# Altium schematic sheet wi-fi.SchDoc
size 420 x 297 mm; Address1: Address1; Address2: Address2; Address3: Address3; Address4: Address4; DocumentNumber: АБВГ.123456.001 Э3; SheetNumber: 3; SheetTotal: 4; Scale: 1:1; DocumentType: Схема электрическая принципиальная; FirstReferrence: АБВГ.123456.001
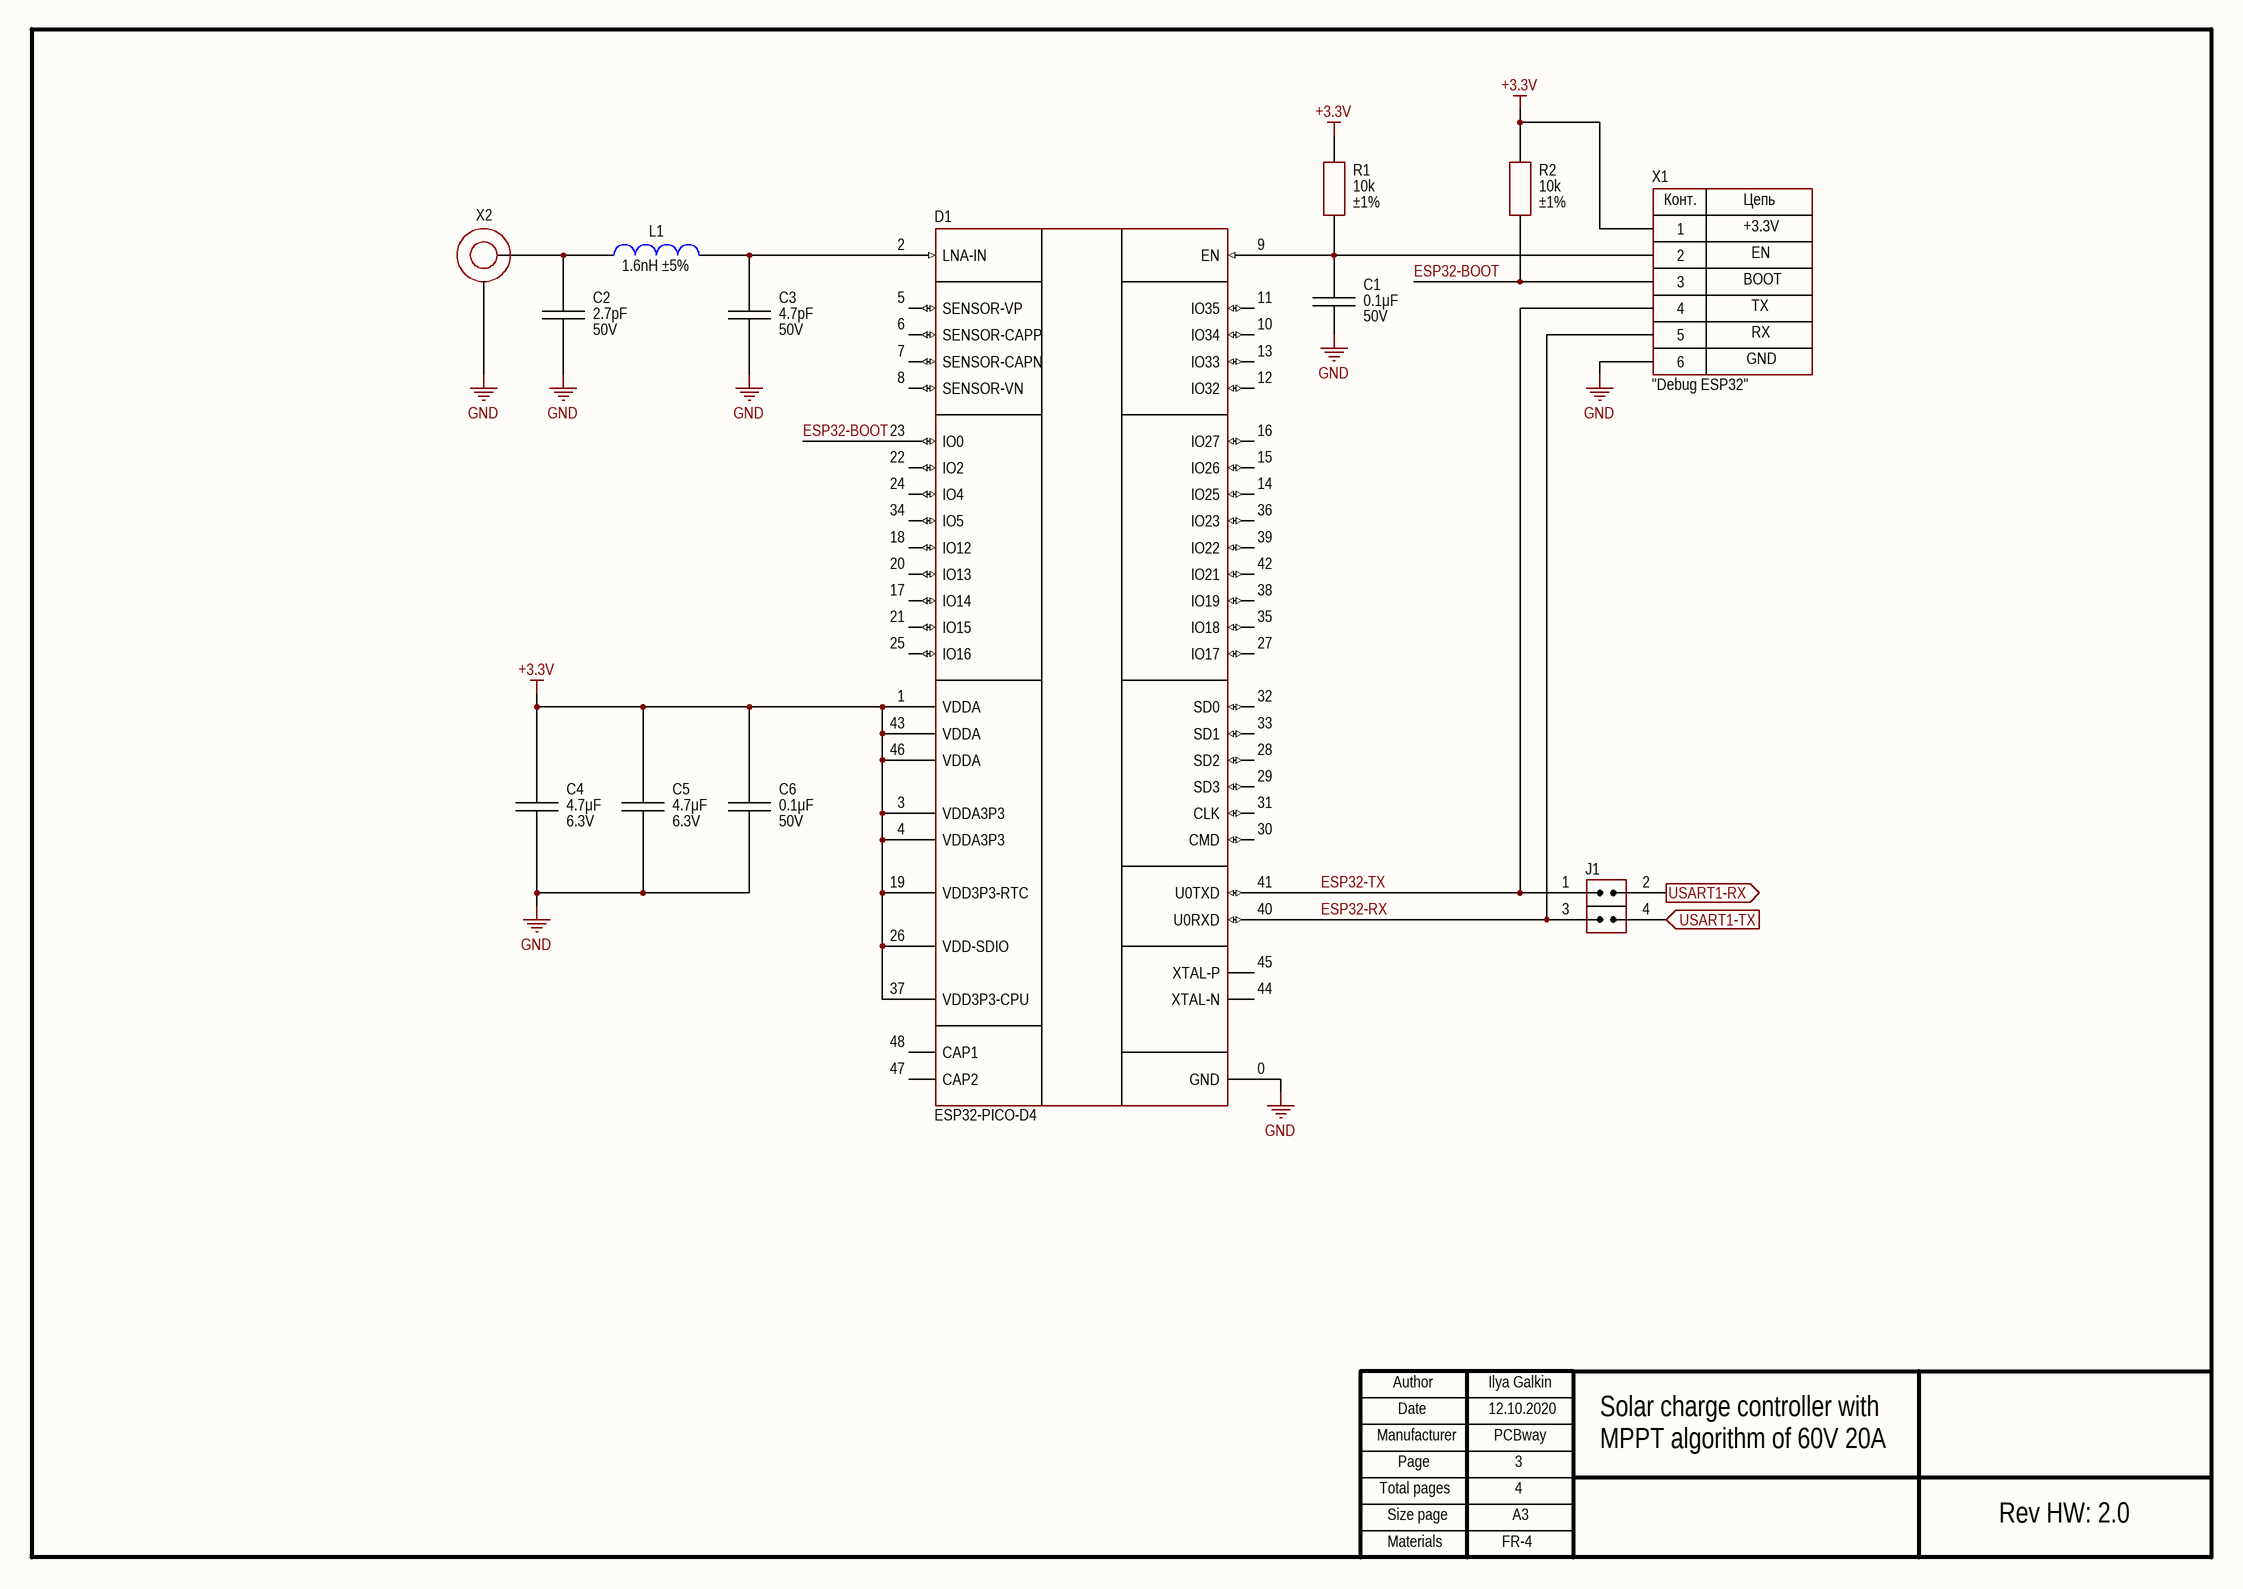
[diagram p0: wi-fi.SchDoc]

## Parts
C1  value 0.1μF  Voltage: 50V  [CAP: 0603]
C2  value 2.7pF  Voltage: 50V  [CAP: 0603]
C3  value 4.7pF  Voltage: 50V  [CAP: 0603]
C4  value 4.7μF  Voltage: 6.3V  [CAP: 0603]
C5  value 4.7μF  Voltage: 6.3V  [CAP: 0603]
C6  value 0.1μF  Voltage: 50V  [CAP: 0603]
D1  (no value)  [48-LGA (7x7)]
J1  (no value)  [CON: JUMPER x2]
L1  value 1.6nH  Tolerance: ±5%  [IND: 0603]
R1  value 10k  Tolerance: ±1%  [RES: 0603]
R2  value 10k  Tolerance: ±1%  [RES: 0603]
X1  CommentText: "Debug ESP32"  [CON: SM06B-GHS]
X2  (no value)  [CON: SMA]

## Ports
USART1-RX (out), USART1-TX (in)

## Nets
+3.3V: C4.2 C5.2 C6.2 D1.1(VDDA) D1.3(VDDA3P3) D1.4(VDDA3P3) D1.19(VDD3P3-RTC) D1.26(VDD-SDIO) D1.37(VDD3P3-CPU) D1.43(VDDA) D1.46(VDDA) R1.2 R2.2 X1.1
GND: C1.1 C2.1 C3.1 C4.1 C5.1 C6.1 D1.0(GND) X1.6 X2.2
ESP32-BOOT: D1.23(IO0) R2.1 X1.3
ESP32-RX: D1.40(U0RXD) J1.3(IN) X1.5
ESP32-TX: D1.41(U0TXD) J1.1(IN) X1.4
USART1-RX: J1.2(IN) ; port USART1-RX
USART1-TX: J1.4(IN) ; port USART1-TX
NetC1_2: C1.2 D1.9(EN) R1.1 X1.2
NetC2_2: C2.2 L1.2 X2.1
NetC3_2: C3.2 D1.2(LNA-IN) L1.1

Not connected (* = marked no-connect by the designer): D1 5(SENSOR-VP) 6(SENSOR-CAPP) 7(SENSOR-CAPN) 8(SENSOR-VN) 10(IO34) 11(IO35) 12(IO32) 13(IO33) 14(IO25) 15(IO26) 16(IO27) 17(IO14) 18(IO12) 20(IO13) 21(IO15) 22(IO2) 24(IO4) 25(IO16) 27(IO17) 28(SD2) 29(SD3) 30(CMD) 31(CLK) 32(SD0) 33(SD1) 34(IO5) 35(IO18) 36(IO23) 38(IO19) 39(IO22) 42(IO21) 44(XTAL-N) 45(XTAL-P) 47(CAP2) 48(CAP1)

## Notes on the sheet
- +3.3V
- EN
- BOOT
- TX
- GND
- RX
- Ilya Galkin
- 12.10.2020
- PCBway
- 3
- Solar charge controller with
- MPPT algorithm of 60V 20A
- 4
- Rev HW: 2.0
- FR-4
- Author
- Manufacturer
- Date
- Page
- Total pages
- Size page
- A3
- Materials
- (in symbol Connector_SM06B) Конт.; Цепь

## Library data of the parts
C1 C6 = Ceramic_0603: Manufacturer: Samsung; PartNumber: CL10B104KB8WPND; ValueManufacturerPartNumber: Ceramic capacitor, 0.1μF, X7R, ±10%, 50V, 0603, -55...+125°C; TypeCapacitor: Ceramic capacitor; Tolerance: ±10%; TypeDielectric: X7R; Package: 0603; HelpURL: https://www.digikey.com/product-detail/en/samsung-electro-mechanics/CL10B104KB8WPND/1276-CL10B104KB8WPNDCT-ND/11488014; Temperature: -55...+125°C
C2 = Ceramic_0603: Manufacturer: Samsung; PartNumber: CL10C2R7CB81PNC; ValueManufacturerPartNumber: Ceramic capacitor, 2.7pF, NPO, ±0.25pF, 50V, 0603, -55...+125°C; TypeCapacitor: Ceramic capacitor; Tolerance: ±0.25pF; TypeDielectric: NPO; Package: 0603; HelpURL: https://www.digikey.com/product-detail/en/samsung-electro-mechanics/CL10C2R7CB81PNC/1276-6554-1-ND/5961413; Temperature: -55...+125°C
C3 = Ceramic_0603: Manufacturer: Samsung; PartNumber: CL10C4R7BB8NNNC; ValueManufacturerPartNumber: Ceramic capacitor, 4.7pF, NPO, ±0.1pF, 50V, 0603, -55...+125°C; TypeCapacitor: Ceramic capacitor; Tolerance: ±0.1pF; TypeDielectric: NPO; Package: 0603; HelpURL: https://www.digikey.com/product-detail/en/samsung-electro-mechanics/CL10C4R7BB8NNNC/1276-1792-1-ND/3889878; Temperature: -55...+125°C
C4 C5 = Ceramic_0603: Manufacturer: Samsung; PartNumber: CL10B475KQ8NQNC; ValueManufacturerPartNumber: Ceramic capacitor, 4.7μF, X7R, ±10%, 6.3V, 0603, -55...+125°C; TypeCapacitor: Ceramic capacitor; Tolerance: ±10%; TypeDielectric: X7R; Package: 0603; HelpURL: https://www.digikey.com/en/products/detail/samsung-electro-mechanics/CL10B475KQ8NQNC/3887745; Temperature: -55...+125°C
D1 = ESP32-PICO-D4: Wi-Fi+BT; Manufacturer: Espressif Systems; ValueManufacturerPartNumber: IC RF transceiver, 802.11b/g/n + Bluetooth v4.2, 2.4GHz, 32-Bit, Xtensa LX6, 4Mb, 520KB, 2.7...3.6V, -40...+85°C, 48-LGA; Supply: 2.7...3.6V; CoreSpeed: 600 DMIPS; CoreSize: 32-Bit; MemoryROM: 4Mb; MemoryRAM: 520KB; CoreProcessor: Xtensa LX6; Frequency: 2.4GHz; TypeProtocol: 802.11b/g/n + Bluetooth v4.2; HelpURL: https://www.digikey.com/product-detail/en/espressif-systems/ESP32-PICO-D4/1904-1029-1-ND/9381738; Package: 48-LGA; ComponentType: IC RF transceiver; Temperature: -40...+85°C; PartNumber: ESP32-PICO-D4
J1 = Jumper_double: CommentText: "Перемычка"
L1 = Inductor_0603: Manufacturer: Murata Electronics; PartNumber: LQW18AS1N6J0ZD; ValueManufacturerPartNumber: Fixed inductor, 1.6nH, ±5%, 0603, 700mA, -55...+125°C; TypeInductor: Fixed inductor; MaxCurrent: 700mA; Package: 0603; HelpURL: https://www.digikey.com/product-detail/en/murata-electronics/LQW18AS1N6J0ZD/490-15806-1-ND/6800471; Temperature: -55...+125°C
R1 R2 = Resistor_0603: Manufacturer: Yageo; PartNumber: AC0603FR-0710KL; ValueManufacturerPartNumber: Resistor film, 10k, ±1%, 0603, 0.1W, -55...+125°C; TypeResistor: Resistor film; Power: 0.1W; Package: 0603; HelpURL: https://www.digikey.com/en/products/detail/yageo/AC0603FR-0710KL/2827814; Temperature: -55...+125°C
X1 = Connector_SM06B: Manufacturer: JST; ValueManufacturerPartNumber: Connector, 6pin, 1.25mm, 50VDC, 1A; PartNumber: SM06B-GHS; VoltageMax: 50VDC; Pitch: 1.25mm; CurrentMax: 1A; Multichannel: 6pin; HelpURL: https://www.digikey.com/product-detail/en/jst-sales-america-inc/SM06B-GHS-TB-LF-SN/455-1568-1-ND/807836; TypeConnector: Connector
X2 = Connector_SMA: Manufacturer: TE Connectivity; ValueManufacturerPartNumber: Connector SMA, 50 Ohm, 3GHz; PartNumber: 5-1814832-1; TypeConnector: Connector SMA; Frequency: 3GHz; Impedance: 50 Ohm; CommentText: "Wi-Fi"; HelpURL: https://www.digikey.com/product-detail/en/te-connectivity-amp-connectors/5-1814832-1/A97594-ND/1755982